# EAGLE schematic FlyballETS-LIGHTS (EAGLE 8.2.2)
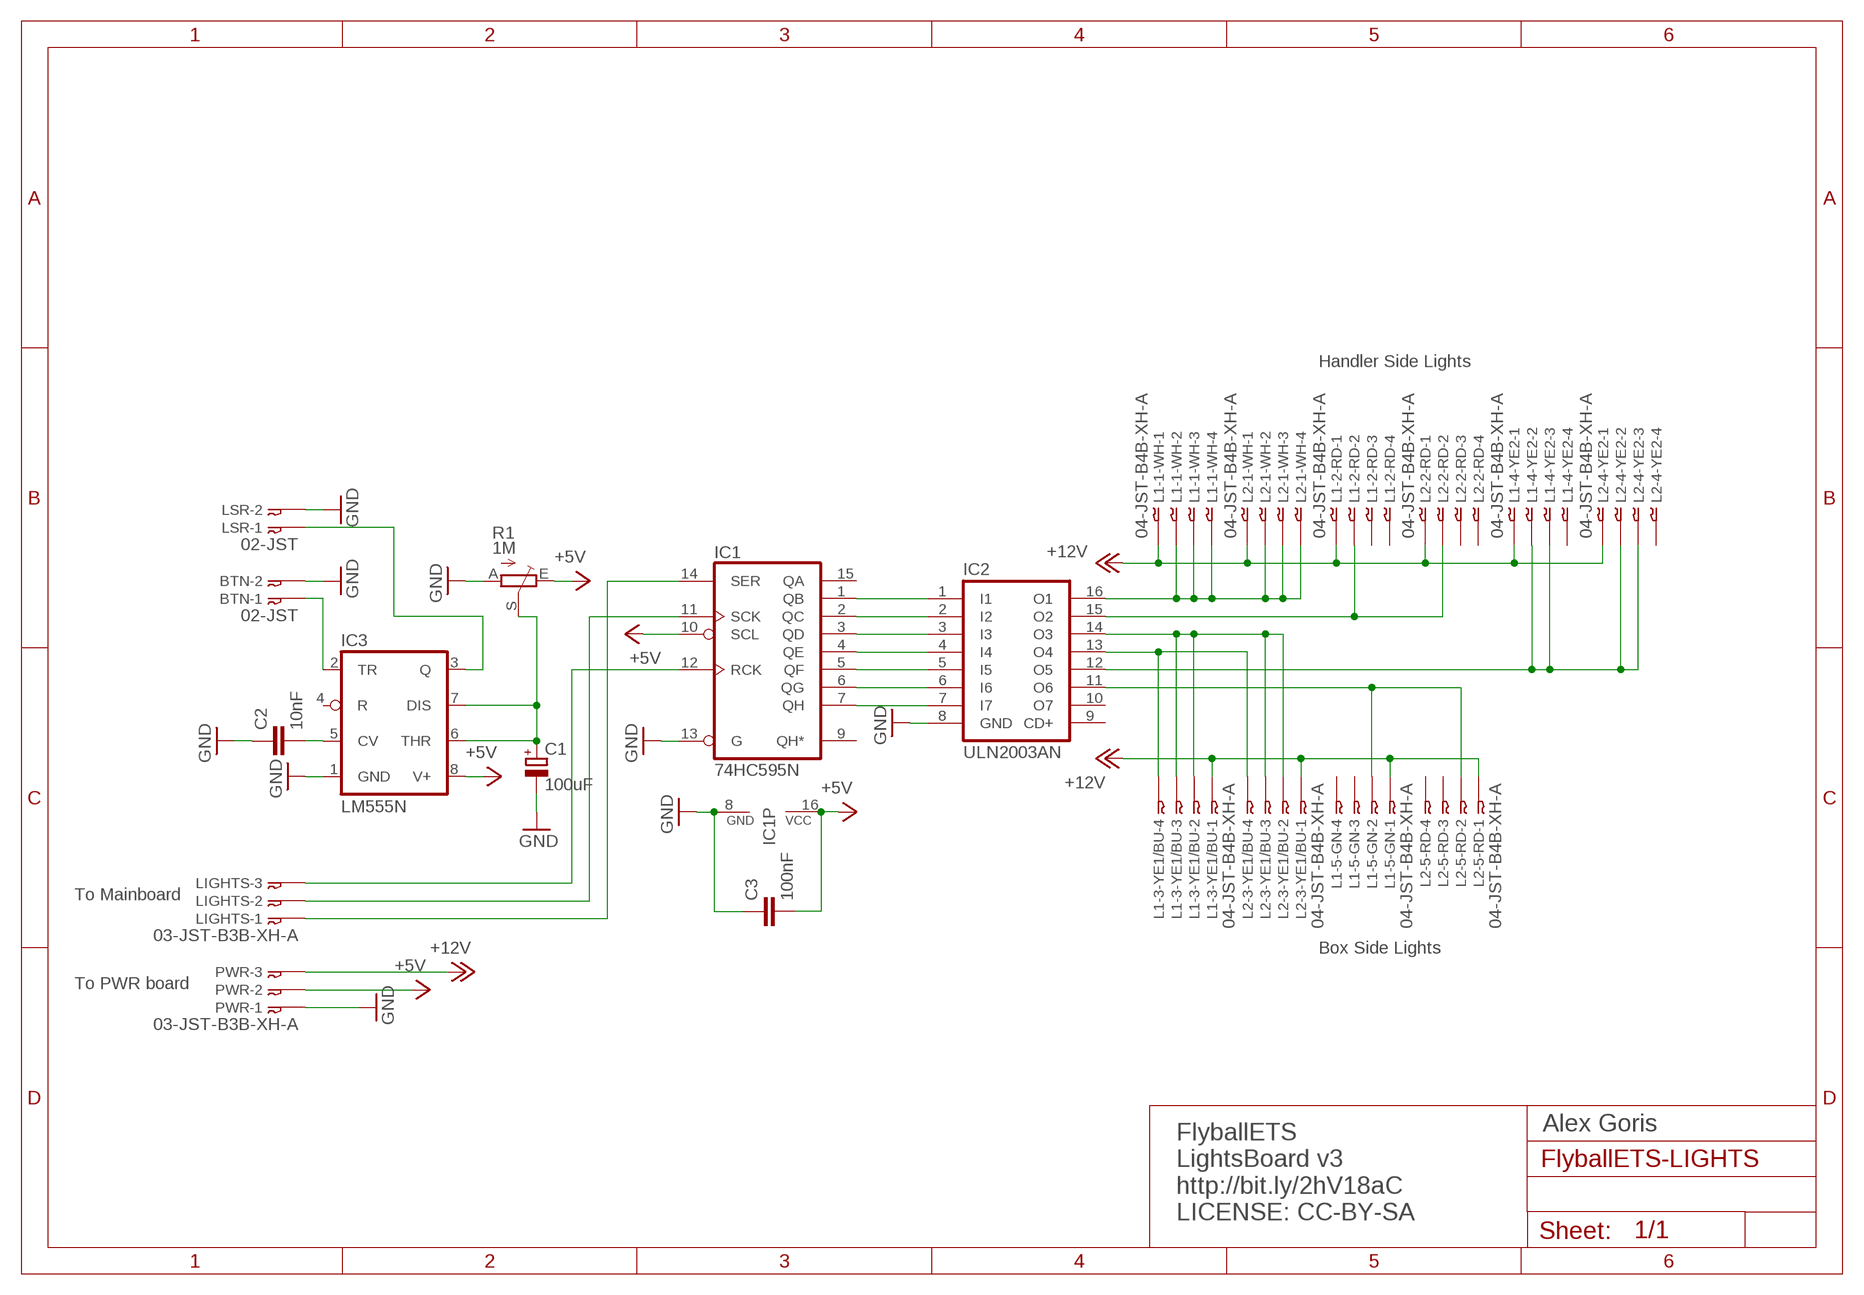
[diagram p0: schematic, sheet 1]

## Parts
BTN  02-JST  [B2B-XH]
C1  100uF  CPOL-EUE2.5-7  [E2,5-7]
C2  10nF  C-EU050-030X075  [C050-030X075]
C3  100nF  C-EU050-030X075  [C050-030X075]
IC1  74HC595N  [DIL16]
IC2  ULN2003AN  [DIL16]
IC3  LM555N  [DIL08]
L1-1-WH  04-JST-B4B-XH-A  [B4B-XH]
L1-2-RD  04-JST-B4B-XH-A  [B4B-XH]
L1-3-YE1/BU  04-JST-B4B-XH-A  [B4B-XH]
L1-4-YE2  04-JST-B4B-XH-A  [B4B-XH]
L1-5-GN  04-JST-B4B-XH-A  [B4B-XH]
L2-1-WH  04-JST-B4B-XH-A  [B4B-XH]
L2-2-RD  04-JST-B4B-XH-A  [B4B-XH]
L2-3-YE1/BU  04-JST-B4B-XH-A  [B4B-XH]
L2-4-YE2  04-JST-B4B-XH-A  [B4B-XH]
L2-5-RD  04-JST-B4B-XH-A  [B4B-XH]
LIGHTS  03-JST-B3B-XH-A  [B3B-XH]
LSR  02-JST  [B2B-XH]
PWR  03-JST-B3B-XH-A  [B3B-XH]
R1  1M  TRIM_EU-B25P  [B25P]

## Nets
+5V: C3.2 IC1.10(SCL) IC1.16(VCC) IC3.8(V+) PWR.P$2 R1.E
+12V: L1-1-WH.P$1 L1-2-RD.P$1 L1-3-YE1/BU.P$1 L1-4-YE2.P$1 L1-5-GN.P$1 L2-1-WH.P$1 L2-2-RD.P$1 L2-3-YE1/BU.P$1 L2-4-YE2.P$1 L2-5-RD.P$1 PWR.P$3
GND: BTN.P$2 C1.- C2.1 C3.1 IC1.8(GND) IC1.13(G) IC2.8(GND) IC3.1(GND) LSR.P$2 PWR.P$1 R1.A
N$1: IC1.14(SER) LIGHTS.P$1
N$2: IC1.11(SCK) LIGHTS.P$2
N$3: IC1.12(RCK) LIGHTS.P$3
N$4: IC1.1(QB) IC2.1(I1)
N$5: IC1.2(QC) IC2.2(I2)
N$6: IC1.3(QD) IC2.3(I3)
N$7: IC1.4(QE) IC2.4(I4)
N$8: IC1.5(QF) IC2.5(I5)
N$9: IC1.6(QG) IC2.6(I6)
N$10: IC1.7(QH) IC2.7(I7)
N$11: C1.+ IC3.6(THR) IC3.7(DIS) R1.S
N$12: C2.2 IC3.5(CV)
N$13: IC2.16(O1) L1-1-WH.P$2 L1-1-WH.P$3 L1-1-WH.P$4 L2-1-WH.P$2 L2-1-WH.P$3 L2-1-WH.P$4
N$14: BTN.P$1 IC3.2(TR)
N$15: IC3.3(Q) LSR.P$1
N$16: IC2.15(O2) L1-2-RD.P$2 L2-2-RD.P$2
N$20: IC2.14(O3) L1-3-YE1/BU.P$2 L1-3-YE1/BU.P$3 L2-3-YE1/BU.P$2 L2-3-YE1/BU.P$3
N$22: IC2.13(O4) L1-3-YE1/BU.P$4 L2-3-YE1/BU.P$4
N$24: IC2.12(O5) L1-4-YE2.P$2 L1-4-YE2.P$3 L2-4-YE2.P$2 L2-4-YE2.P$3
N$29: IC2.11(O6) L1-5-GN.P$2 L2-5-RD.P$2
Unconnected: IC1.9(QH*) IC1.15(QA) IC2.9(CD+) IC2.10(O7) IC3.4(R) L1-2-RD.P$3 L1-2-RD.P$4 L1-4-YE2.P$4 L1-5-GN.P$3 L1-5-GN.P$4 L2-2-RD.P$3 L2-2-RD.P$4 L2-4-YE2.P$4 L2-5-RD.P$3 L2-5-RD.P$4

## Notes on the sheet
- Handler Side Lights
- To Mainboard
- Box Side Lights
- To PWR board
- Alex Goris
- FlyballETS
  LightsBoard v3
  http://bit.ly/2hV18aC
  LICENSE: CC-BY-SA

## Library data of the parts
BTN LSR = bt_con-jst-xh:02-JST: JST CONNECTOR
C1 = resistor:CPOL-EU: POLARIZED CAPACITOR, European symbol
C2 C3 = resistor:C-EU: CAPACITOR, European symbol
IC1 = 74xx-eu:74*595: 8-bit SHIFT REGISTER, output latch
IC2 = uln-udn:ULN2003A: DRIVER ARRAY
IC3 = linear:*555: TIMER
L1-1-WH L1-2-RD L1-3-YE1/BU L1-4-YE2 L1-5-GN L2-1-WH L2-2-RD L2-3-YE1/BU L2-4-YE2 L2-5-RD = bt_con-jst-xh:04-JST: JST CONNECTOR
LIGHTS PWR = bt_con-jst-xh:03-JST: JST CONNECTOR
R1 = pot:TRIM_EU-: POTENTIOMETER